# EAGLE schematic subor (EAGLE 6.4)
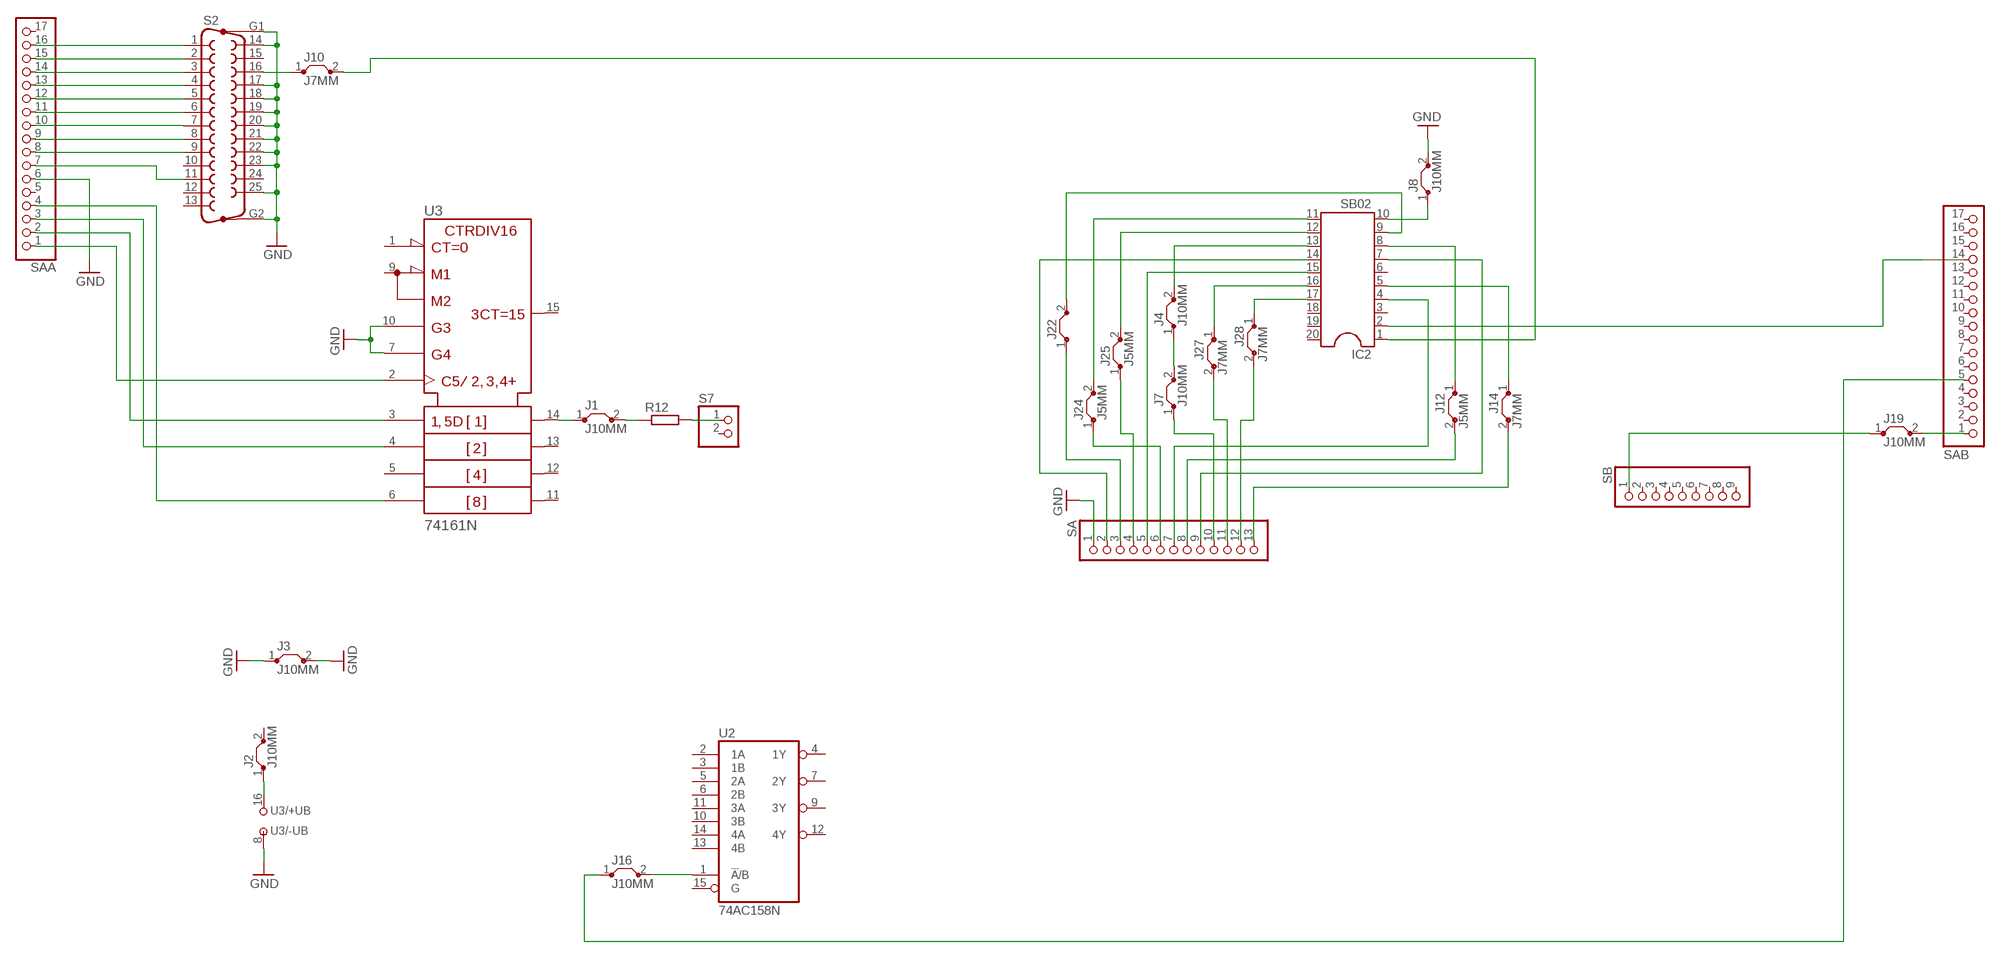
[diagram p0: schematic, sheet 1]

## Parts
IC2  SB02  DIL20  [DIL20]
J1  J10MM  [10]
J2  J10MM  [10]
J3  J10MM  [10]
J4  J10MM  [10]
J7  J10MM  [10]
J8  J10MM  [10]
J10  J7MM  [07]
J12  J5MM  [05]
J14  J7MM  [07]
J16  J10MM  [10]
J19  J10MM  [10]
J22  J10MM  [10]
J24  J5MM  [05]
J25  J5MM  [05]
J27  J7MM  [07]
J28  J7MM  [07]
R12  R-EU_0207/10  [0207/10]
S2  F25HP  [F25HP]
S7  PINHD-1X2  [1X02]
SA  PINHD-1X13/90  [1X13/90]
SAA  PINHD-1X17  [1X17]
SAB  PINHD-1X17  [1X17]
SB  PINHD-1X9/90  [1X09/90]
U2  74AC158N  [DIL16]
U3  74161N  [DIL16]

## Nets
GND: J3.1 J3.2 J8.2 S2.14 S2.17 S2.18 S2.19 S2.20 S2.21 S2.22 S2.23 S2.25 S2.G1 S2.G2 SA.1 SAA.6 U3.7(ENP) U3.8(-UB) U3.10(ENT)
N$1: SAA.1 U3.2(CLK)
N$2: SAA.2 U3.3(A)
N$3: SAA.3 U3.4(B)
N$4: SAA.4 U3.6(D)
N$5: J10.1 S2.16
N$6: R12.2 S7.1
N$7: IC2.1 J10.2
N$8: S2.1 SAA.16
N$9: S2.2 SAA.15
N$10: S2.3 SAA.14
N$11: S2.4 SAA.13
N$12: S2.5 SAA.12
N$13: S2.6 SAA.11
N$14: S2.7 SAA.10
N$15: S2.8 SAA.9
N$16: S2.9 SAA.8
N$17: S2.11 SAA.7
N$18: J2.1 U3.16(+UB)
N$19: J1.1 U3.14(QA)
N$20: J1.2 R12.1
N$21: IC2.14 SA.2
N$22: IC2.11 J24.2
N$23: IC2.9 J22.2
N$24: J25.1 SA.4
N$25: J24.1 SA.6
N$26: IC2.12 J25.2
N$27: IC2.16 J27.1
N$28: IC2.4 SA.7
N$29: IC2.8 J12.1
N$30: J12.2 SA.8
N$31: IC2.7 SA.9
N$32: J7.1 SA.10
N$33: J4.1 J7.2
N$34: IC2.13 J4.2
N$35: J27.2 SA.11
N$36: J19.2 SAB.1
N$37: J19.1 SB.1
N$38: J16.2 U2.1(!A!/B)
N$39: J16.1 SAB.5
N$40: J22.1 SA.3
N$41: IC2.10 J8.1
N$42: IC2.15 SA.5
N$43: J28.2 SA.12
N$44: IC2.17 J28.1
N$45: IC2.5 J14.1
N$46: J14.2 SA.13
N$47: IC2.2
Unconnected: IC2.3 IC2.6 IC2.18 IC2.19 IC2.20 J2.2 S2.10 S2.12 S2.13 S2.15 S2.24 S7.2 SAA.5 SAA.17 SAB.2 SAB.3 SAB.4 SAB.6 SAB.7 SAB.8 SAB.9 SAB.10 SAB.11 SAB.12 SAB.13 SAB.14 SAB.15 SAB.16 SAB.17 SB.2 SB.3 SB.4 SB.5 SB.6 SB.7 SB.8 SB.9 U2.2(1A) U2.3(1B) U2.4(1Y) U2.5(2A) U2.6(2B) U2.7(2Y) U2.9(3Y) U2.10(3B) U2.11(3A) U2.12(4Y) U2.13(4B) U2.14(4A) U2.15(G) U3.1(!CLR) U3.5(C) U3.9(!LOAD) U3.11(QD) U3.12(QC) U3.13(QB) U3.15(RCO)

## Power pins joined to a net without a drawn wire
GND: U2.8(GND)
VCC: U2.16(VCC)

## Library data of the parts
IC2 = ic-package:DIL20: Dual In Line / Socket
J1-J4 J7 J8 J10 J12 J14 J16 J19 J22 J24 J25 J27 J28 = jumper:J: Bridge
R12 = rcl:R-EU_: RESISTOR, European symbol
S2 = con-subd:F25HP: SUB-D; OC_FARNELL: unknown; OC_NEWARK: unknown
S7 = Разъёмы штырьковые 2.54мм:PINHD-1X2: PIN HEADER
SA = Разъёмы штырьковые 2.54мм:PINHD-1X13: PIN HEADER
SAA SAB = Разъёмы штырьковые 2.54мм:PINHD-1X17: PIN HEADER
SB = Разъёмы штырьковые 2.54мм:PINHD-1X9: PIN HEADER
U2 = 74xx-eu:74*158: Quadruple 2-line to 1-line data SELECTOR/MULTIPLEXER
U3 = 74ttl-din:74*161: Synchrounus 4-bit COUNTER